# EasyEDA Pro project TeensySensor.eprj, schematic Sigyn Sensor Board

## Sheets
1 Teensy: Board Name: Board1; Create Date: 2025-06-20; Page Name: Teensy; Project Name: TeensySensor; Schematic Name: Sigyn Sensor Board; Update Date: 2025-06-20; Company: Wimble Robotics; Drawed: Michael Wimble; Page Size: A4; Part Number: JLCPCB-002; Reviewed: Michael Wimble; Version: V1.0
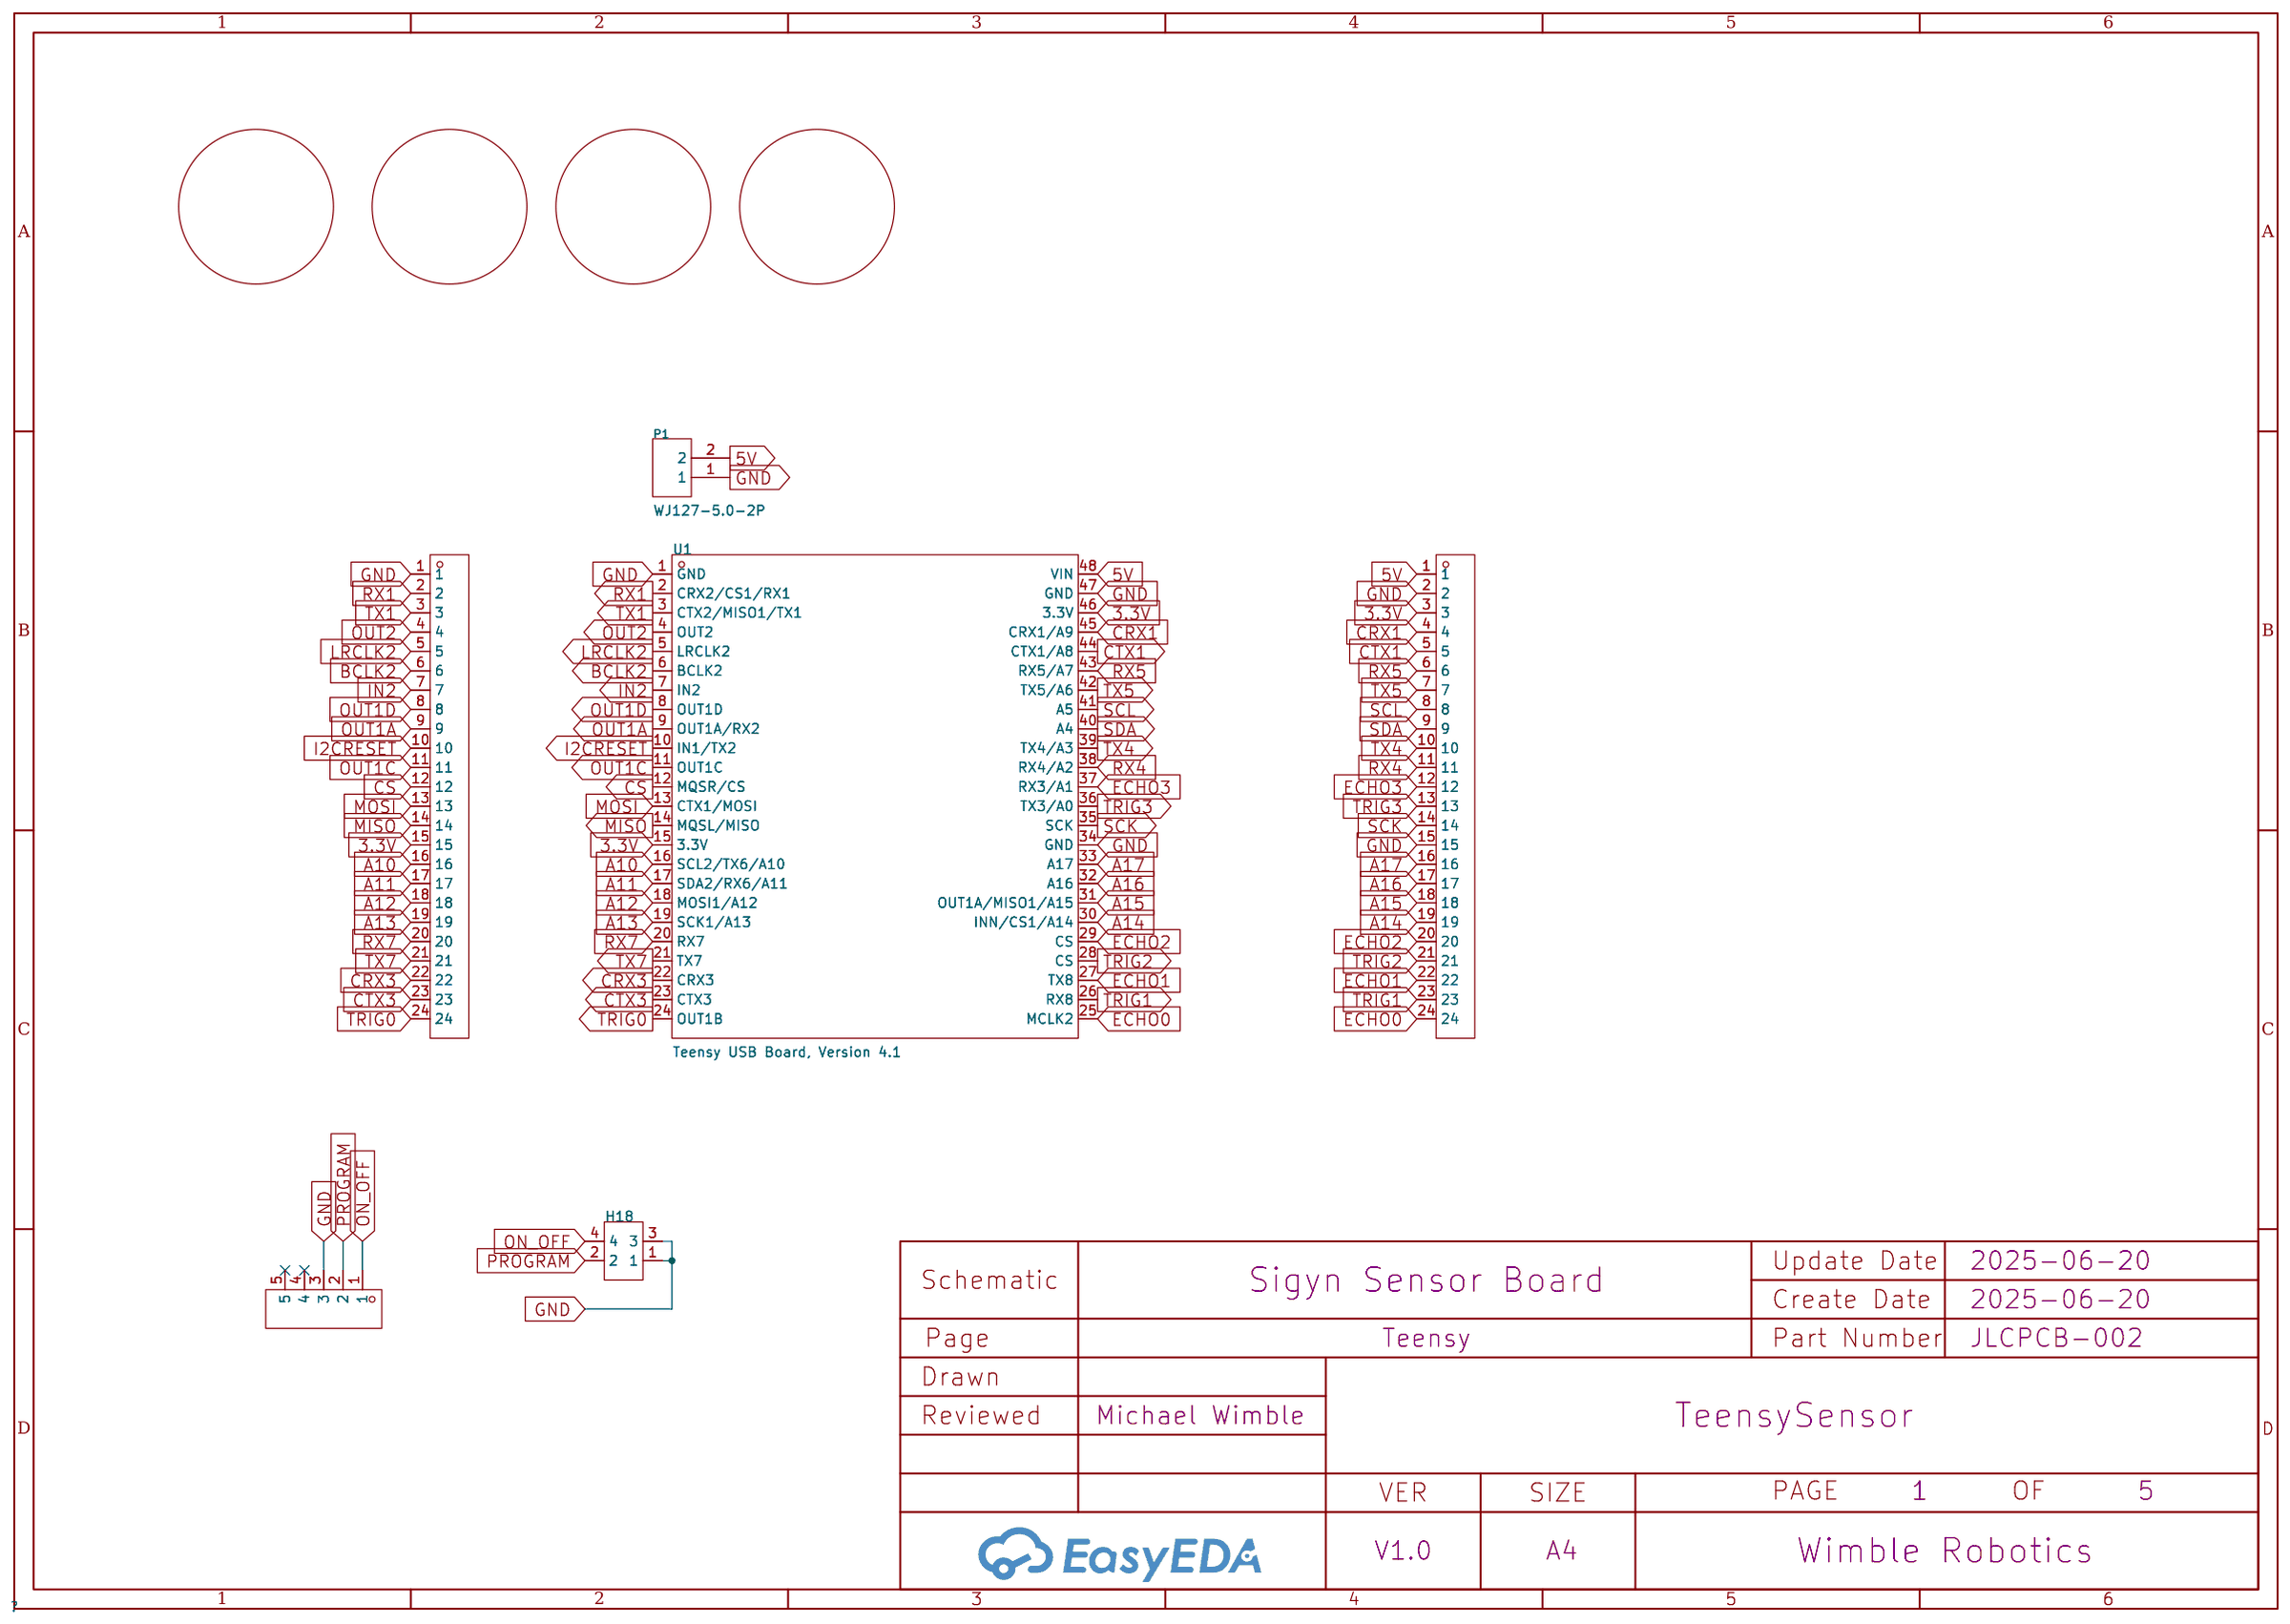
[diagram p0: Teensy]
2 Time of Flight Sensors: Page Name: Time of Flight Sensors; Update Date: 2025-06-19
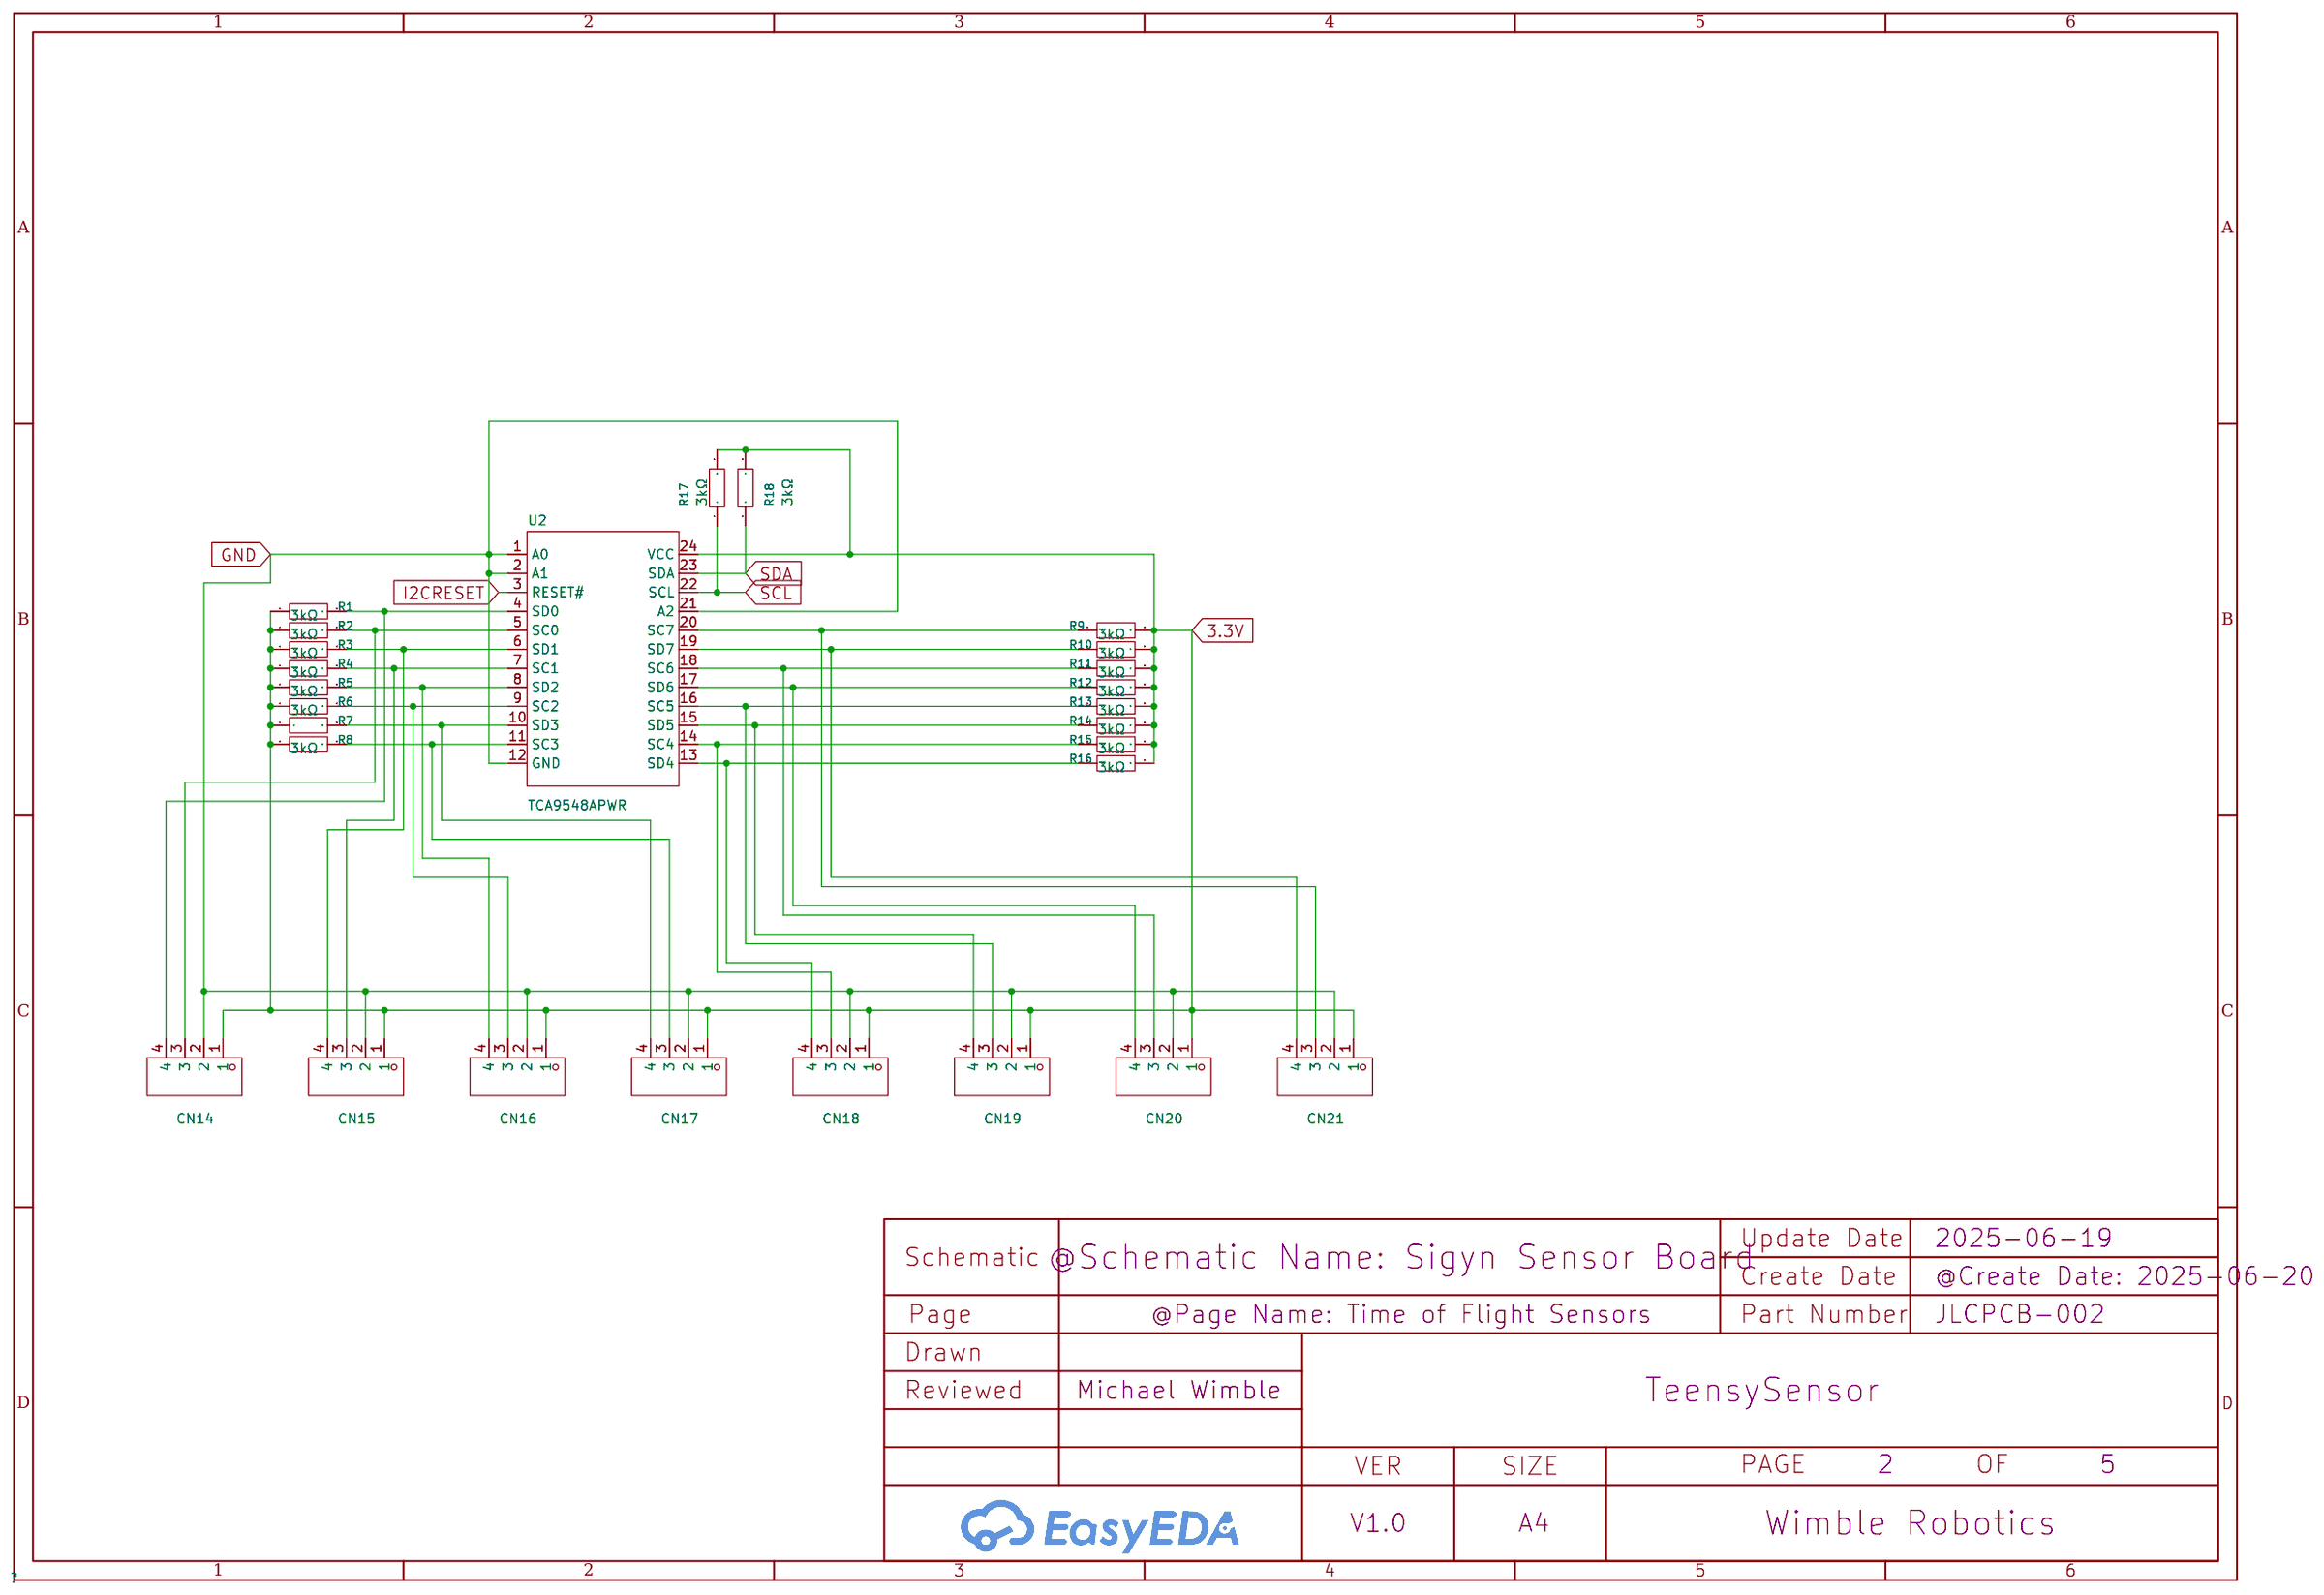
[diagram p1: Time of Flight Sensors]
3 Analog Inputs / Misc: Page Name: Analog Inputs / Misc
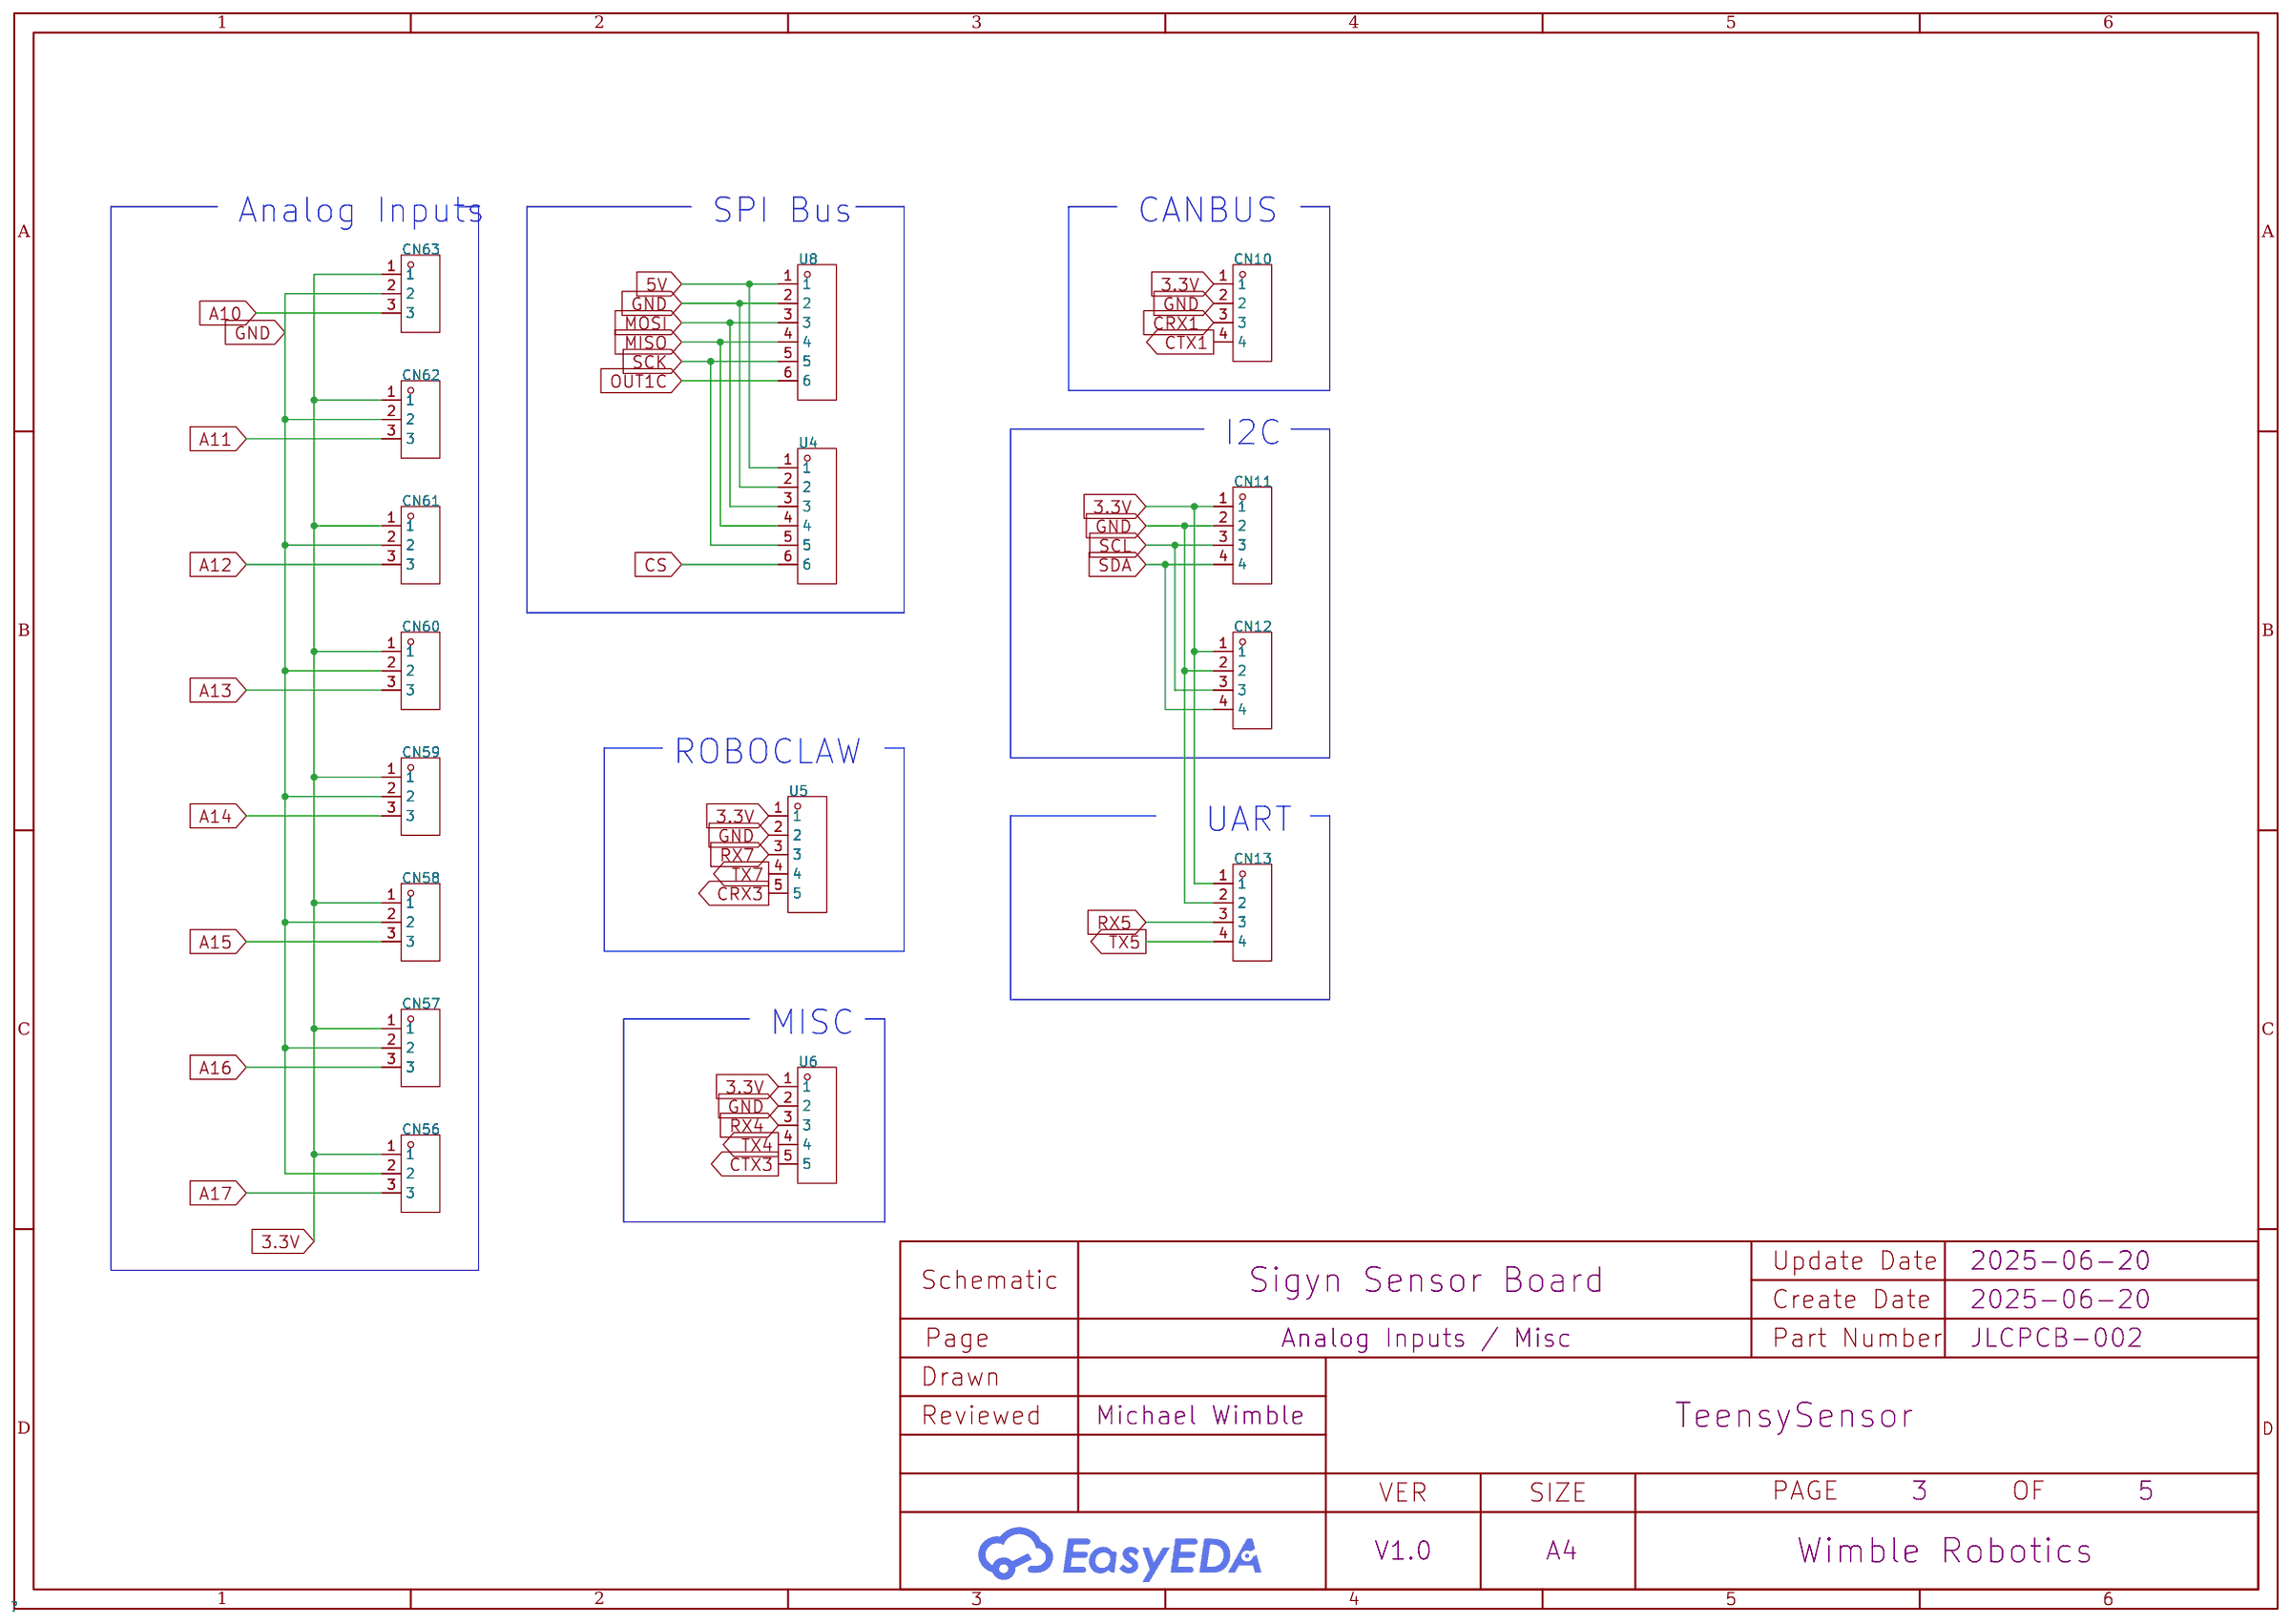
[diagram p2: Analog Inputs / Misc]
4 SONAR: Page Name: SONAR; Update Date: 2025-06-19
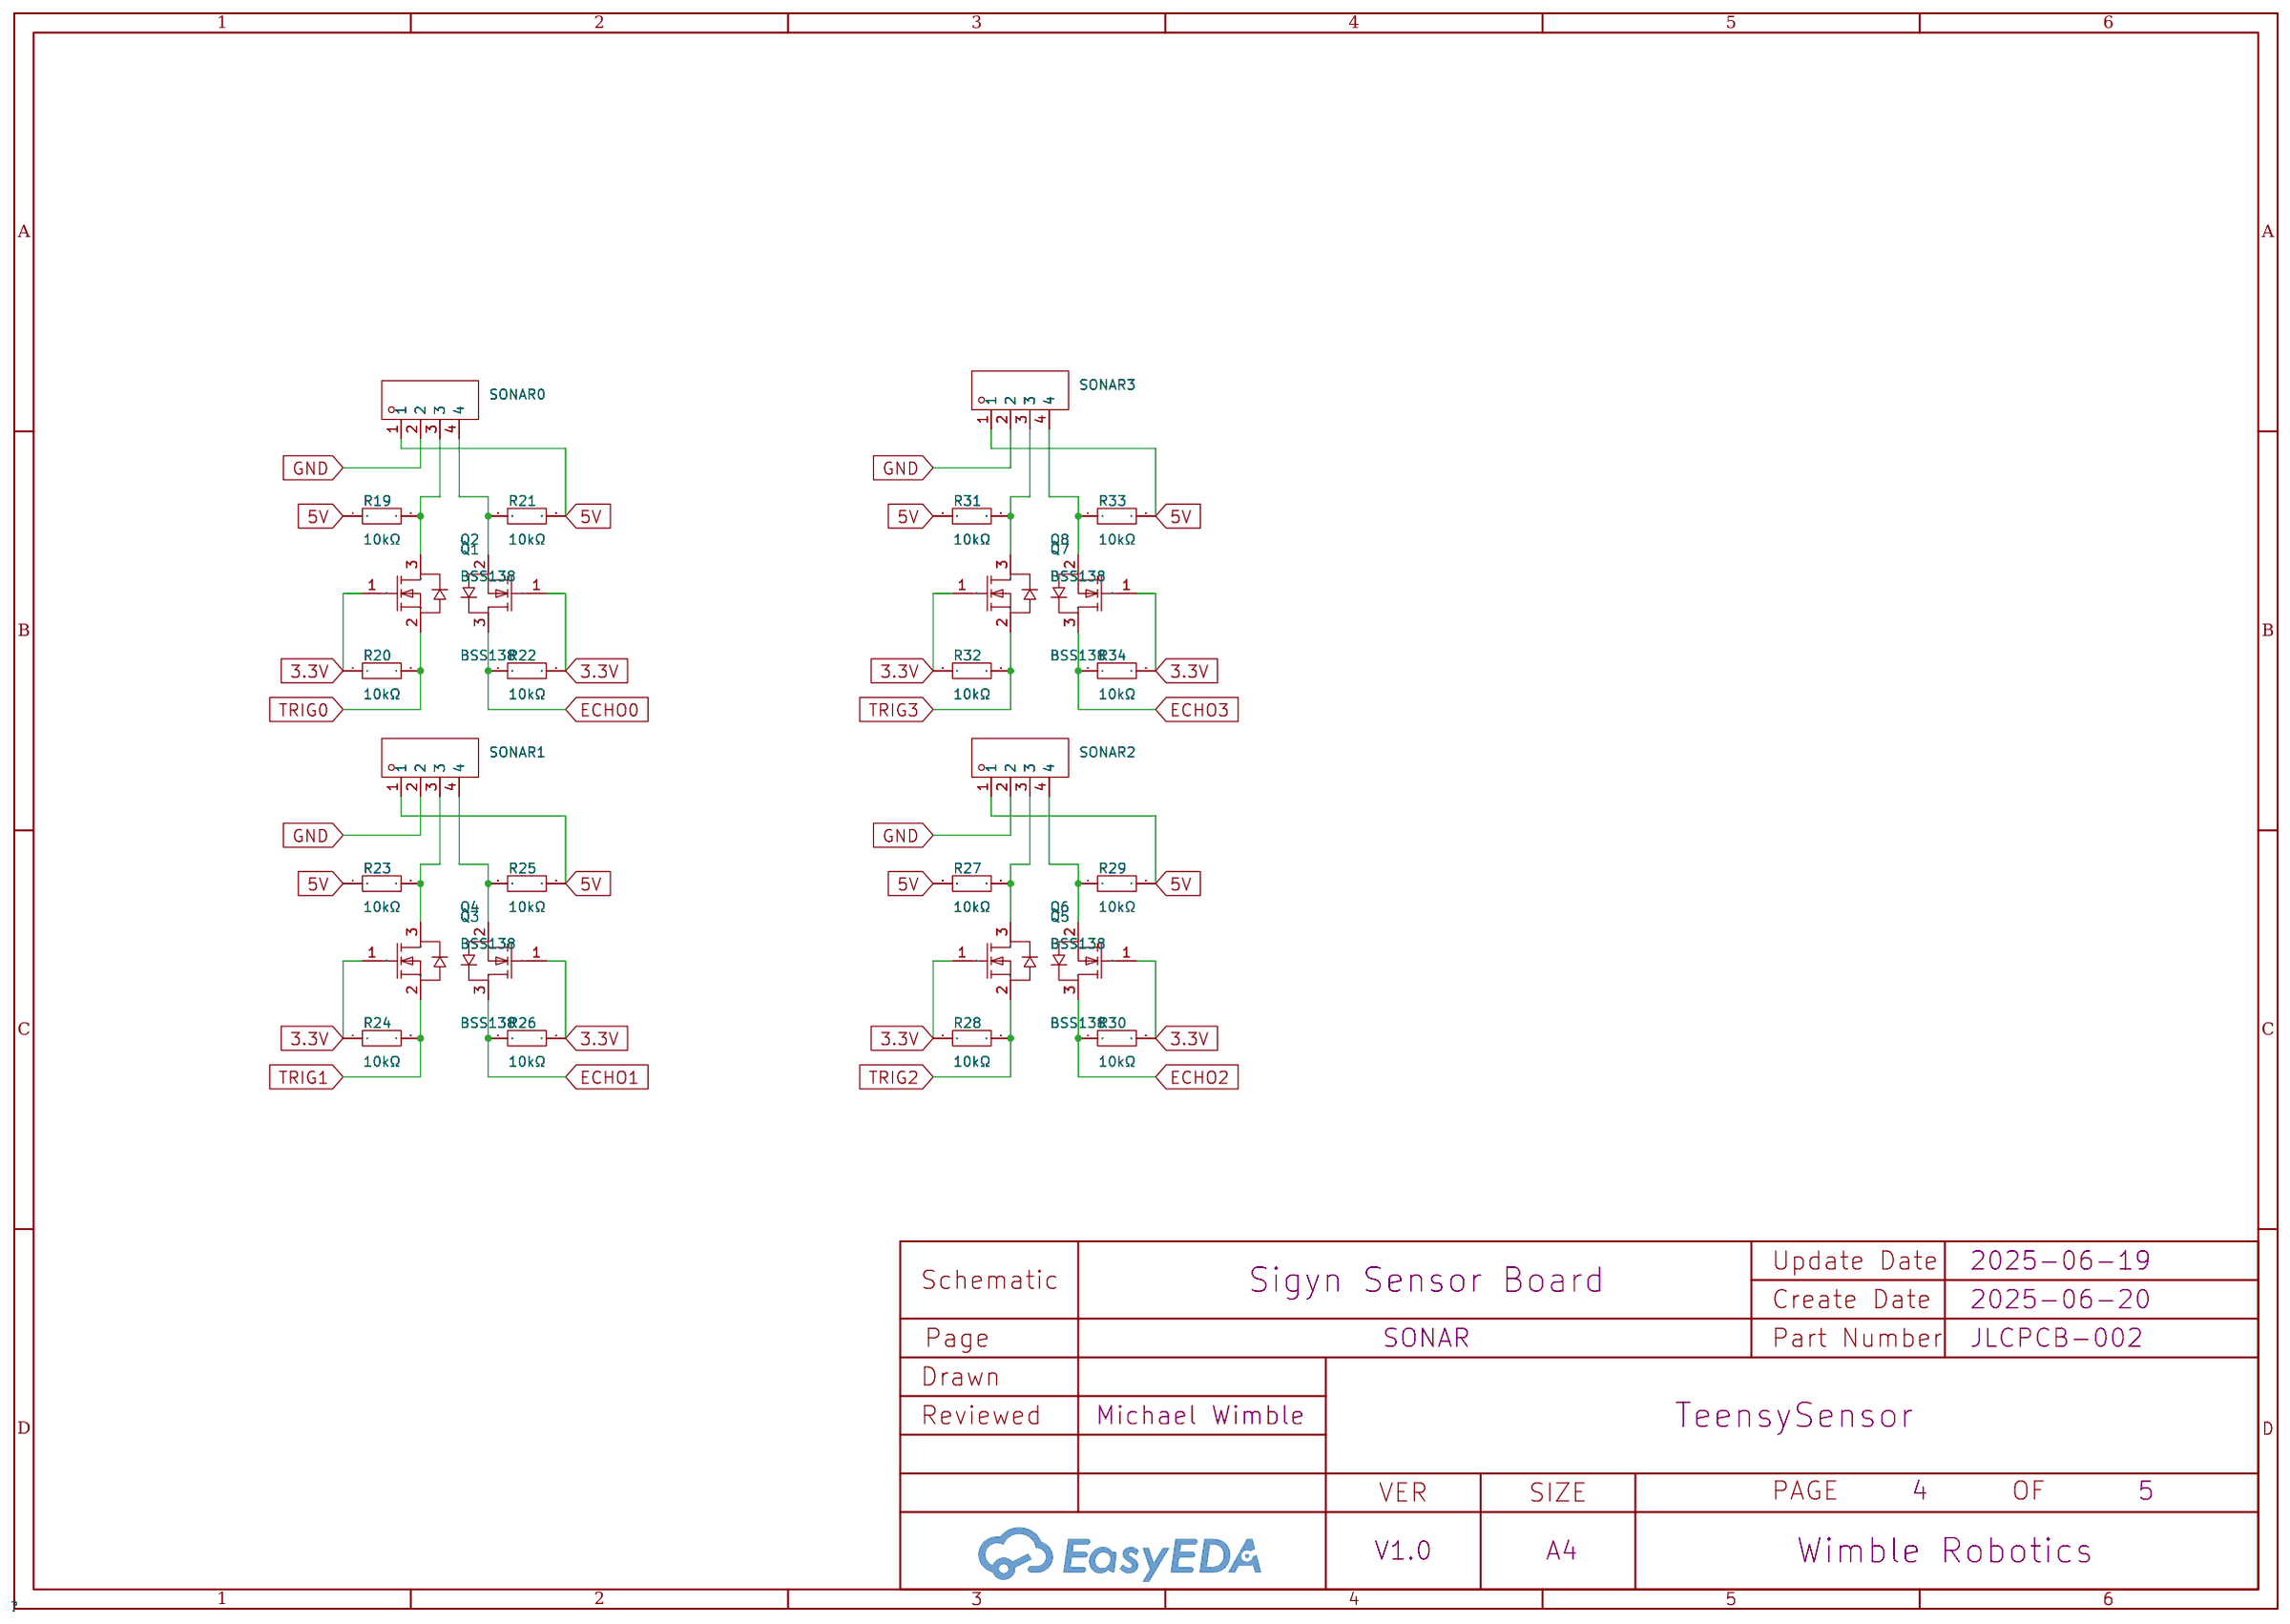
[diagram p3: SONAR]
5 Relays / PWM: Page Name: Relays / PWM
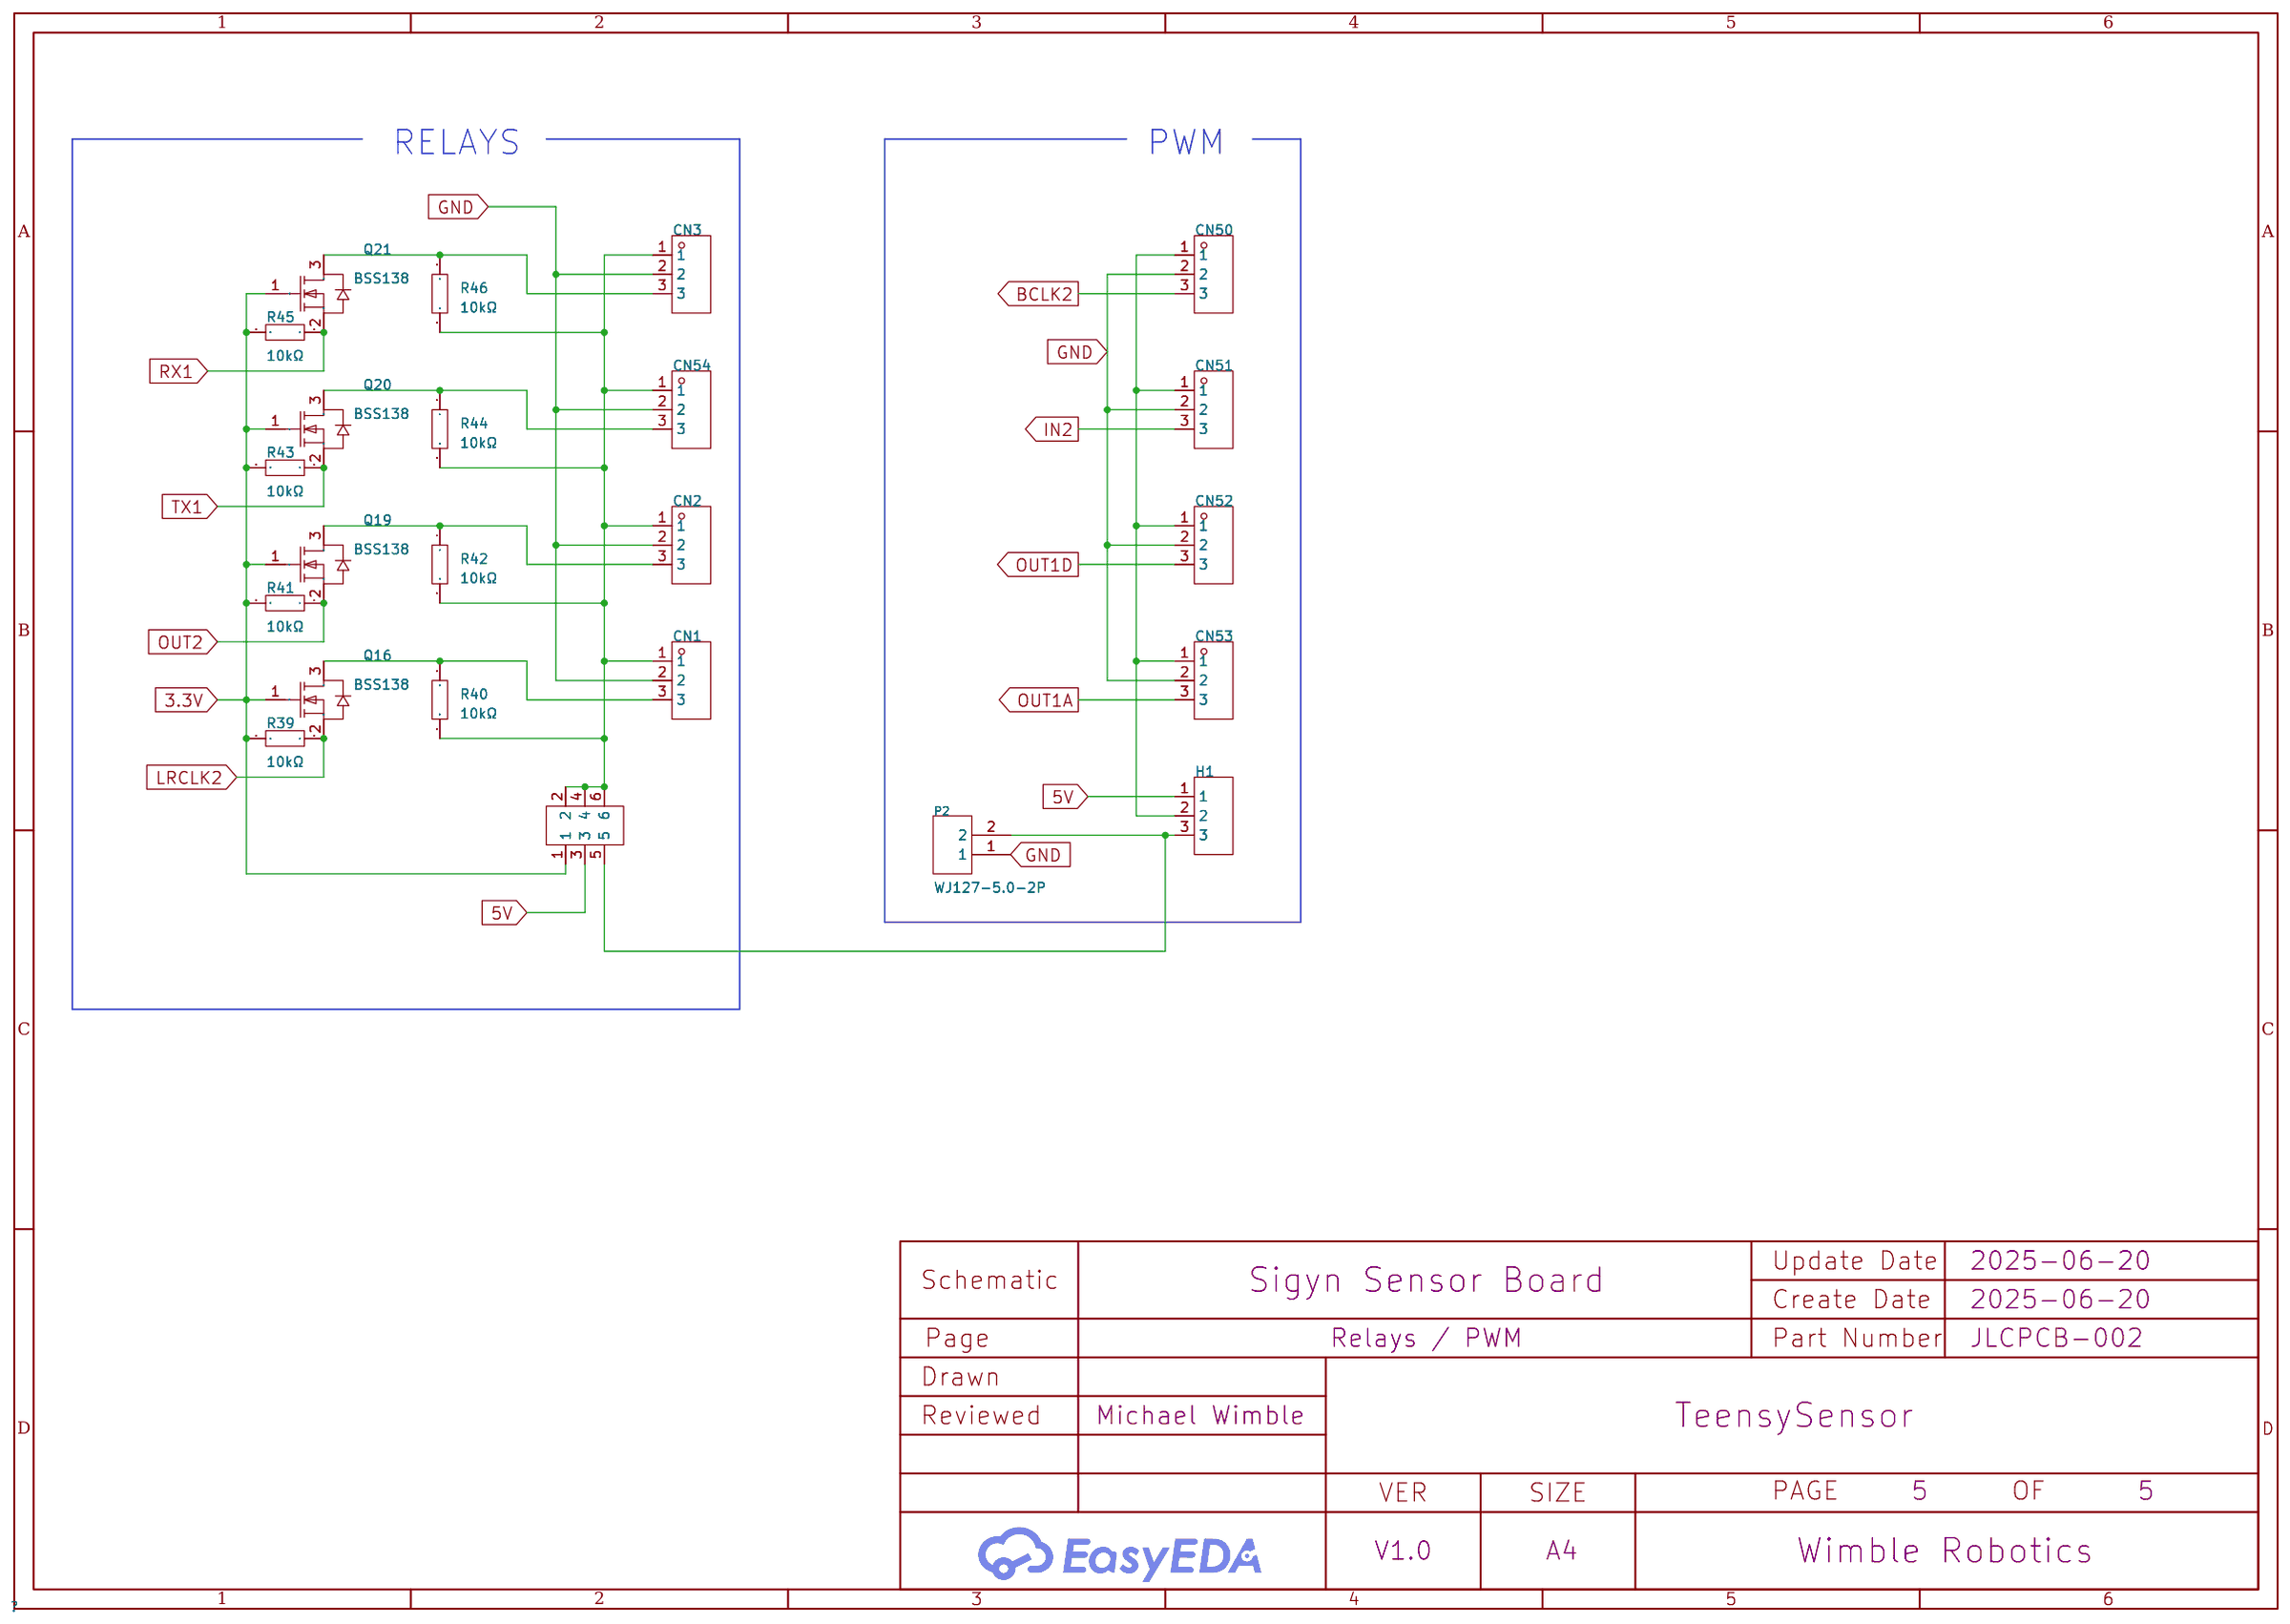
[diagram p4: Relays / PWM]

## Parts
sheet Analog Inputs / Misc
CN10  ZX-XH2.54-4PZZ  [CONN-TH_4P-P2.50_4PIN]
CN11  ZX-XH2.54-4PZZ  [CONN-TH_4P-P2.50_4PIN]
CN12  ZX-XH2.54-4PZZ  [CONN-TH_4P-P2.50_4PIN]
CN13  ZX-XH2.54-4PZZ  [CONN-TH_4P-P2.50_4PIN]
CN56  ZX-XH2.54-3PZZ  [CONN-TH_3P-P2.54_2501S-3P]
CN57  ZX-XH2.54-3PZZ  [CONN-TH_3P-P2.54_2501S-3P]
CN58  ZX-XH2.54-3PZZ  [CONN-TH_3P-P2.54_2501S-3P]
CN59  ZX-XH2.54-3PZZ  [CONN-TH_3P-P2.54_2501S-3P]
CN60  ZX-XH2.54-3PZZ  [CONN-TH_3P-P2.54_2501S-3P]
CN61  ZX-XH2.54-3PZZ  [CONN-TH_3P-P2.54_2501S-3P]
CN62  ZX-XH2.54-3PZZ  [CONN-TH_3P-P2.54_2501S-3P]
CN63  ZX-XH2.54-3PZZ  [CONN-TH_3P-P2.54_2501S-3P]
U4  ZX-XH2.54-6PZZ  [CONN-TH_6P-P2.50_ZX-XH2.54-6PZZ]
U5  ZX-XH2.54-5PZZ  [CONN-TH_5P-P2.50_ZX-XH2.54-5PZZ]
U6  ZX-XH2.54-5PZZ  [CONN-TH_5P-P2.50_ZX-XH2.54-5PZZ]
U8  ZX-XH2.54-6PZZ  [CONN-TH_6P-P2.50_ZX-XH2.54-6PZZ]
sheet Relays / PWM
CN1  ZX-XH2.54-3PZZ  [CONN-TH_3P-P2.54_2501S-3P]
CN2  ZX-XH2.54-3PZZ  [CONN-TH_3P-P2.54_2501S-3P]
CN3  ZX-XH2.54-3PZZ  [CONN-TH_3P-P2.54_2501S-3P]
CN50  ZX-XH2.54-3PZZ  [CONN-TH_3P-P2.54_2501S-3P]
CN51  ZX-XH2.54-3PZZ  [CONN-TH_3P-P2.54_2501S-3P]
CN52  ZX-XH2.54-3PZZ  [CONN-TH_3P-P2.54_2501S-3P]
CN53  ZX-XH2.54-3PZZ  [CONN-TH_3P-P2.54_2501S-3P]
CN54  ZX-XH2.54-3PZZ  [CONN-TH_3P-P2.54_2501S-3P]
H1  PZ254V-11-03P  [HDR-TH_3P-P2.54-V-M]
P2  WJ127-5.0-2P  [CONN-TH_2P-P5.00_CPC3703CTR]
Q16  BSS138  [SOT-23-3_L2.9-W1.6-P1.90-LS2.8-BR]
Q19  BSS138  [SOT-23-3_L2.9-W1.6-P1.90-LS2.8-BR]
Q20  BSS138  [SOT-23-3_L2.9-W1.6-P1.90-LS2.8-BR]
Q21  BSS138  [SOT-23-3_L2.9-W1.6-P1.90-LS2.8-BR]
R39  10kΩ  [R0603]
R40  10kΩ  [R0603]
R41  10kΩ  [R0603]
R42  10kΩ  [R0603]
R43  10kΩ  [R0603]
R44  10kΩ  [R0603]
R45  10kΩ  [R0603]
R46  10kΩ  [R0603]
U19  BX-PZ2.54-2-3PZZ  [HDR-TH_6P-P2.54-V-M-R2-C3-S2.54]
sheet SONAR
Q1  BSS138  [SOT-23-3_L2.9-W1.6-P1.90-LS2.8-BR]
Q2  BSS138  [SOT-23-3_L2.9-W1.6-P1.90-LS2.8-BR]
Q3  BSS138  [SOT-23-3_L2.9-W1.6-P1.90-LS2.8-BR]
Q4  BSS138  [SOT-23-3_L2.9-W1.6-P1.90-LS2.8-BR]
Q5  BSS138  [SOT-23-3_L2.9-W1.6-P1.90-LS2.8-BR]
Q6  BSS138  [SOT-23-3_L2.9-W1.6-P1.90-LS2.8-BR]
Q7  BSS138  [SOT-23-3_L2.9-W1.6-P1.90-LS2.8-BR]
Q8  BSS138  [SOT-23-3_L2.9-W1.6-P1.90-LS2.8-BR]
R19  10kΩ  [R0603]
R20  10kΩ  [R0603]
R21  10kΩ  [R0603]
R22  10kΩ  [R0603]
R23  10kΩ  [R0603]
R24  10kΩ  [R0603]
R25  10kΩ  [R0603]
R26  10kΩ  [R0603]
R27  10kΩ  [R0603]
R28  10kΩ  [R0603]
R29  10kΩ  [R0603]
R30  10kΩ  [R0603]
R31  10kΩ  [R0603]
R32  10kΩ  [R0603]
R33  10kΩ  [R0603]
R34  10kΩ  [R0603]
SONAR0  ZX-XH2.54-4PZZ  [CONN-TH_4P-P2.50_4PIN]
SONAR1  ZX-XH2.54-4PZZ  [CONN-TH_4P-P2.50_4PIN]
SONAR2  ZX-XH2.54-4PZZ  [CONN-TH_4P-P2.50_4PIN]
SONAR3  ZX-XH2.54-4PZZ  [CONN-TH_4P-P2.50_4PIN]
sheet Teensy
H18  HX PZ2.54-2x2P ZZ  [HDR-TH_HX-PZ2.54-2X2P-ZZ]
P1  WJ127-5.0-2P  [CONN-TH_2P-P5.00_CPC3703CTR]
U1  Teensy USB Board, Version 4.1  [COMM-TH_L61.0-W17.8-P2.54]
U12  -  [3.5mm_Hole]
U13  -  [3.5mm_Hole]
U14  -  [3.5mm_Hole]
U15  -  [3.5mm_Hole]
U43  HC-PM254-8.5H-1x24PZ  [HDR-TH_24P-P2.54-V-F]
U44  HC-PM254-8.5H-1x24PZ  [HDR-TH_24P-P2.54-V-F]
U48  PM2.54-1*5  [HDR-TH_5P-P2.54-V-F]
sheet Time of Flight Sensors
CN14  ZX-XH2.54-4PZZ  [CONN-TH_4P-P2.50_4PIN]
CN15  ZX-XH2.54-4PZZ  [CONN-TH_4P-P2.50_4PIN]
CN16  ZX-XH2.54-4PZZ  [CONN-TH_4P-P2.50_4PIN]
CN17  ZX-XH2.54-4PZZ  [CONN-TH_4P-P2.50_4PIN]
CN18  ZX-XH2.54-4PZZ  [CONN-TH_4P-P2.50_4PIN]
CN19  ZX-XH2.54-4PZZ  [CONN-TH_4P-P2.50_4PIN]
CN20  ZX-XH2.54-4PZZ  [CONN-TH_4P-P2.50_4PIN]
CN21  ZX-XH2.54-4PZZ  [CONN-TH_4P-P2.50_4PIN]
R1  3kΩ  [R0603]
R2  3kΩ  [R0603]
R3  3kΩ  [R0603]
R4  3kΩ  [R0603]
R5  3kΩ  [R0603]
R6  3kΩ  [R0603]
R7  3kΩ  [R0603]
R8  3kΩ  [R0603]
R9  3kΩ  [R0603]
R10  3kΩ  [R0603]
R11  3kΩ  [R0603]
R12  3kΩ  [R0603]
R13  3kΩ  [R0603]
R14  3kΩ  [R0603]
R15  3kΩ  [R0603]
R16  3kΩ  [R0603]
R17  3kΩ  [R0603]
R18  3kΩ  [R0603]
U2  TCA9548APWR  [TSSOP-24_L7.8-W4.4-P0.65-LS6.4-BL]

## Library data of the parts
CN10-CN21 SONAR0-SONAR3 = ZX-XH2.54-4PZZ: Pins Structure:1x4P Pitch:2.5mm Mounting Type:Direct Insert Reference Series:XH Number of Pins:4P Number of Rows:1 Number of PINs Per Row:4 Row Spacing:- Rated Current:3A Contact Material:Brass Contact Plating:Tin Operating Temperature:-25℃~+85℃ Operating; LCSC Part Name: 1x4P 间距:2.5mm 直插 系列:XH; Supplier Part: C7429634; Manufacturer: Megastar(兆星); Supplier Footprint: 插件,P=2.5mm; JLCPCB Part Class: Extended Part; Datasheet: https://atta.szlcsc.com/upload/public/pdf/source/20230619/B529A2163E0159A644AB3383D208FB03.pdf; Supplier: LCSC; Pins Structure: 1x4P; Pitch: 2.5mm; Mounting Type: Direct Insert; Reference Series: XH; Number of Pins: 4P; Number of Rows: 1; Number of PINs Per Row: 4; Rated Current: 3A; Contact Material: Brass; Contact Plating: Tin; Operating Temperature: -25℃~+85℃; Rated Voltage (Max): 250V; Plastic Material: PA66; Flame Retardant Rating: UL94V-0; Color: White; Z-Height of the Board: 7mm; X-Length of Bottom Edge on Board (Spacing Line): 12.5mm; Y-Width of Bottom Edge on Board: 5.9mm
CN1-CN3 CN50-CN54 CN56-CN63 = ZX-XH2.54-3PZZ: Pins Structure:1x3P Pitch:2.5mm Mounting Type:Direct Insert Reference Series:XH Number of Pins:3P Number of Rows:1 Number of PINs Per Row:3 Row Spacing:- Rated Current:3A Contact Material:Brass Contact Plating:Tin Operating Temperature:-25℃~+85℃ Operating; LCSC Part Name: 1x3P 间距:2.5mm 直插 系列:XH; Supplier Part: C7429633; Manufacturer: Megastar(兆星); Supplier Footprint: 插件,P=2.5mm; JLCPCB Part Class: Extended Part; Datasheet: https://atta.szlcsc.com/upload/public/pdf/source/20230619/AE17037A2CFDBE8D9CBA775D61AD0A84.pdf; Supplier: LCSC; Pins Structure: 1x3P; Pitch: 2.5mm; Mounting Type: Direct Insert; Reference Series: XH; Number of Pins: 3P; Number of Rows: 1; Number of PINs Per Row: 3; Rated Current: 3A; Contact Material: Brass; Contact Plating: Tin; Operating Temperature: -25℃~+85℃; Rated Voltage (Max): 250V; Plastic Material: PA66; Flame Retardant Rating: UL94V-0; Color: White; Z-Height of the Board: 7mm; X-Length of Bottom Edge on Board (Spacing Line): 10mm; Y-Width of Bottom Edge on Board: 5.9mm
U4 U8 = ZX-XH2.54-6PZZ: Pins Structure:1x6P Pitch:2.5mm Mounting Type:Direct Insert Reference Series:XH Number of Pins:6P Number of Rows:1 Number of PINs Per Row:6 Row Spacing:- Rated Current:3A Contact Material:Brass Contact Plating:Tin Operating Temperature:-25℃~+85℃ Operating; LCSC Part Name: 1x6P 间距:2.5mm 直插 系列:XH; Supplier Part: C7429636; Manufacturer: Megastar(兆星); Supplier Footprint: 插件,P=2.5mm; JLCPCB Part Class: Extended Part; Datasheet: https://atta.szlcsc.com/upload/public/pdf/source/20230619/1243AD0A516E39CD3D274D8985780568.pdf; Supplier: LCSC; Pins Structure: 1x6P; Pitch: 2.5mm; Mounting Type: Direct Insert; Reference Series: XH; Number of Pins: 6P; Number of Rows: 1; Number of PINs Per Row: 6; Rated Current: 3A; Contact Material: Brass; Contact Plating: Tin; Operating Temperature: -25℃~+85℃; Rated Voltage (Max): 250V; Plastic Material: PA66; Flame Retardant Rating: UL94V-0; Color: White; Z-Height of the Board: 7mm; X-Length of Bottom Edge on Board (Spacing Line): 17.5mm; Y-Width of Bottom Edge on Board: 5.9mm
U5 U6 = ZX-XH2.54-5PZZ: Pins Structure:1x5P Pitch:2.5mm Mounting Type:Direct Insert Reference Series:XH Number of Pins:5P Number of Rows:1 Number of PINs Per Row:5 Row Spacing:- Rated Current:3A Contact Material:Brass Contact Plating:Tin Operating Temperature:-25℃~+85℃ Operating; LCSC Part Name: 1x5P 间距:2.5mm 直插 系列:XH; Supplier Part: C7429635; Manufacturer: Megastar(兆星); Supplier Footprint: 插件,P=2.5mm; JLCPCB Part Class: Extended Part; Datasheet: https://atta.szlcsc.com/upload/public/pdf/source/20230619/60EEF4ADD558E90BFFACF5D939816781.pdf; Supplier: LCSC; Pins Structure: 1x5P; Pitch: 2.5mm; Mounting Type: Direct Insert; Reference Series: XH; Number of Pins: 5P; Number of Rows: 1; Number of PINs Per Row: 5; Rated Current: 3A; Contact Material: Brass; Contact Plating: Tin; Operating Temperature: -25℃~+85℃; Rated Voltage (Max): 250V; Plastic Material: PA66; Flame Retardant Rating: UL94V-0; Color: White; Z-Height of the Board: 7mm; X-Length of Bottom Edge on Board (Spacing Line): 15mm; Y-Width of Bottom Edge on Board: 5.9mm
H1 = PZ254V-11-03P: Pin Structure:1x3P Pitch:2.54mm Row Spacing:- Circluar Pins/Square Pins:Policy Mounting Type:Straight Number of Rows:Single Row Number of Pins:3P Current Rating:3A Voltage Rating (Max):250V Length of Mating Pin:6mm Insulation Height:2.5mm Length of End Co; LCSC Part Name: 1x3P 间距:2.54mm 方针 直插; Supplier Part: C2937625; Manufacturer: XFCN(兴飞); Supplier Footprint: 插件,P=2.54mm; JLCPCB Part Class: Extended Part; Datasheet: https://atta.szlcsc.com/upload/public/pdf/source/20200309/C492402_8335C3D49C4E4C618838D59BB1D024C1.pdf; Supplier: LCSC; Pin Structure: 1x3P; Pitch: 2.54mm; Circluar Pins/Square Pins: Policy; Mounting Type: Straight; Number of Rows: Single Row; Number of Pins: 3P; Current Rating: 3A; Voltage Rating (Max): 250V; Length of Mating Pin: 6mm; Insulation Height: 2.5mm; Length of End Connection Pin: 3mm; Operating Temperature: -40℃~+105℃; Color: Black
P1 P2 = WJ127-5.0-2P_C3703: Structure:1x2P Pitch:5mm Color:Green Mounting Style:Straight Current Rating (Max):15A Voltage Rating (Max):250V Number of Pins:2P Number of Rows:1 Wire Gauge - AWG:14~26 Wire Gauge - AWG:14~26 Wire Gauge - mm2:1.5 Wire Gauge - mm2:1.5 Number of PINs Per R; LCSC Part Name: 5mm 1x2P 排数:1 每排P数:2 直插; Supplier Part: C3703; Manufacturer: KANGNEX(康奈克斯电气); Supplier Footprint: 插件,P=5mm; JLCPCB Part Class: Extended Part; Datasheet: https://atta.szlcsc.com/upload/public/pdf/source/20191225/C3703_1F4D1F1BB9E32B564BC518663FFF2A0C.pdf; Supplier: LCSC; Structure: 1x2P; Pitch: 5mm; Color: Green; Mounting Style: Straight; Current Rating (Max): 15A; Voltage Rating (Max): 250V; Number of Pins: 2P; Number of Rows: 1; Wire Gauge - AWG: 14~26; Wire Gauge - mm2: 1.5; Number of PINs Per Row: 2; Operating Temperature Range: -40℃~+105℃
Q1-Q8 Q16 Q19-Q21 = BSS138_C18212695: Drain to Source Voltage:50V Current - Continuous Drain(Id):360mA RDS(on):2Ω@2.5V,0.1A Pd - Power Dissipation:350mW Gate Threshold Voltage (Vgs(th)@Id):800mV Gate Charge(Qg):4nC@25V Input Capacitance(Ciss@Vds):32pF Reverse Transfer Capacitance (Crss@Vds):3; LCSC Part Name: 耐压:50V 电流:360mA; Supplier Part: C18212695; Manufacturer: TECH PUBLIC(台舟); Supplier Footprint: SOT-23; JLCPCB Part Class: Extended Part; Datasheet: https://atta.szlcsc.com/upload/public/pdf/source/20231024/96ACE9C5A32B7F4113654DA9CE24FCA4.pdf; Supplier: LCSC; Drain to Source Voltage: 50V; Current - Continuous Drain(Id): 360mA; RDS(on): 2Ω@2.5V,0.1A; Pd - Power Dissipation: 350mW; Gate Threshold Voltage (Vgs(th)@Id): 800mV; Gate Charge(Qg): 4nC@25V; Input Capacitance(Ciss@Vds): 32pF; Reverse Transfer Capacitance (Crss@Vds): 3pF@25V; Operating Temperature: -55℃~+150℃
R19-R34 R39-R46 = RC0603FR-0710KL: Type:Thick Film Resistors Resistance: Tolerance:±1% Tolerance:±1% Power(Watts): Overload Voltage (Max): Temperature Coefficient:±100ppm/℃ Temperature Coefficient:±100ppm/℃ Operating Temperature Range:-55℃~+155℃ Operating Temperature Range:-55℃~+155℃; LCSC Part Name: 厚膜电阻 10kΩ ±1% 100mW; Supplier Part: C98220; Manufacturer: YAGEO(国巨); Supplier Footprint: 0603; JLCPCB Part Class: Extended Part; Datasheet: https://atta.szlcsc.com/upload/public/pdf/source/20180927/C295883_E8D83085EA81BD7DE0B2B681138C15EE.pdf; Supplier: LCSC; Type: Thick Film Resistors; Tolerance: ±1%; Temperature Coefficient: ±100ppm/℃; Operating Temperature Range: -55℃~+155℃
U19 = BX-PZ2.54-2-3PZZ: Pin Structure:2x3P Pitch:2.54mm Row Spacing:2.54mm Circluar Pins/Square Pins:Policy Mounting Type:Straight Number of Rows:Double Row Number of Pins:3P Current Rating:3A Voltage Rating (Max):1kV Length of Mating Pin:6mm Insulation Height:2.5mm Length of En; LCSC Part Name: 2x3P 间距:2.54mm 方针 直插; Supplier Part: C18078212; Manufacturer: Bossie(博锡); Supplier Footprint: 插件,P=2.54mm; JLCPCB Part Class: Extended Part; Datasheet: https://atta.szlcsc.com/upload/public/pdf/source/20231017/19B93BCADDDD73CB54F402EECF4A0840.pdf; Supplier: LCSC; Pin Structure: 2x3P; Pitch: 2.54mm; Row Spacing: 2.54mm; Circluar Pins/Square Pins: Policy; Mounting Type: Straight; Number of Rows: Double Row; Number of Pins: 3P; Current Rating: 3A; Voltage Rating (Max): 1kV; Length of Mating Pin: 6mm; Insulation Height: 2.5mm; Length of End Connection Pin: 3mm; Contact Material: Brass; Contact Plating: Gold; Operating Temperature: -40℃~+105℃; Color: Black
H18 = HX PZ2.54-2x2P ZZ: Pin Structure:2x2P Pitch:2.54mm Row Spacing:2.54mm Circluar Pins/Square Pins:Policy Mounting Type:Straight Number of Rows:Double Row Number of Pins:4P Current Rating:3A Voltage Rating (Max):- Length of Mating Pin:6mm Insulation Height:2.5mm Length of End; LCSC Part Name: 2x2P 间距:2.54mm 方针 直插; Supplier Part: C32713275; Manufacturer: hanxia(韩下); Supplier Footprint: 插件,P=2.54mm; JLCPCB Part Class: Extended Part; Datasheet: https://atta.szlcsc.com/upload/public/pdf/source/20240723/CE5FF0E3D3DC0CA9D26CA3411A561CD4.pdf; Supplier: LCSC; Pin Structure: 2x2P; Pitch: 2.54mm; Row Spacing: 2.54mm; Circluar Pins/Square Pins: Policy; Mounting Type: Straight; Number of Rows: Double Row; Number of Pins: 4P; Current Rating: 3A; Length of Mating Pin: 6mm; Insulation Height: 2.5mm; Length of End Connection Pin: 3mm; Contact Material: Brass; Contact Plating: Gold; Operating Temperature: -40℃~+105℃; Color: Black
U1 = Teensy USB Board, Version 4.1: Supplier Part: C9900060513; Supplier Footprint: 插件; JLCPCB Part Class: Extended Part; Supplier: LCSC
U12-U15 = 3.5MMHole: Mounting hole
U43 U44 = HC-PM254-8.5H-1x24PZ: Holes Structure:1x24P Pitch:2.54mm Row Spacing:- Circular Hole / Square Hole:Square Hole Mounting Type:Direct Insert Number of Rows:Single Row Number of Positions:24P Current Rating:3A Voltage Rating (Max):- Holes Direction:Top Insulation Height:8.5mm Con; LCSC Part Name: 间距2.54mm 1x24Pin 直插 PC3.0 H8.5; Supplier Part: C41376163; Manufacturer: HC(虹成电子); Supplier Footprint: 插件,P=2.54mm; JLCPCB Part Class: Extended Part; Datasheet: https://atta.szlcsc.com/upload/public/pdf/source/20250106/3FBD04873CC9DF7EB7D4CB725B508409.pdf; Supplier: LCSC; Holes Structure: 1x24P; Pitch: 2.54mm; Circular Hole / Square Hole: Square Hole; Mounting Type: Direct Insert; Number of Rows: Single Row; Number of Positions: 24P; Current Rating: 3A; Holes Direction: Top; Insulation Height: 8.5mm; Contact Material: Brass; Contact Plating: Gold; Operating Temperature: -40℃~+105℃; PIN Length: 3mm
U48 = PM2.54-1*5: Holes Structure:1x5P Pitch:2.54mm Row Spacing:2.54mm Circular Hole / Square Hole:方孔 Mounting Type:Straight Number of Rows:Plugin Number of Holes:5P Current Rating (Max):2.5A Holes Direction:Top Insulation Height:8.5mm Operating Temperature Range:-40℃~+105; LCSC Part Name: 间距:2.54mm 1x5P 直插; Supplier Part: C5116488; Manufacturer: ZHOURI(洲日); Supplier Footprint: 插件,P=2.54mm; JLCPCB Part Class: Extended Part; Datasheet: https://atta.szlcsc.com/upload/public/pdf/source/20220803/9CD49C6F5EDF44A82395C8C3734B0185.pdf; Supplier: LCSC; Holes Structure: 1x5P; Pitch: 2.54mm; Row Spacing: 2.54mm; Circular Hole / Square Hole: 方孔; Mounting Type: Straight; Number of Rows: Plugin; Number of Holes: 5P; Current Rating (Max): 2.5A; Holes Direction: Top; Insulation Height: 8.5mm; Operating Temperature Range: -40℃~+105℃
R1-R18 = 0603WAF3001T5E: Type:Thick Film Resistors Resistance:3kΩ Tolerance:±1% Tolerance:±1% Power(Watts):0.1W Voltage-Supply(Max):75V Temperature Coefficient:±100ppm/℃ Temperature Coefficient:±100ppm/℃ Operating Temperature:-55℃~+155℃ Operating Temperature:-55℃~+155℃; LCSC Part Name: 3kΩ ±1% 100mW 厚膜电阻; Supplier Part: C4211; Manufacturer: UNI-ROYAL(厚声); Supplier Footprint: 0603; JLCPCB Part Class: Basic Part; Datasheet: https://atta.szlcsc.com/upload/public/pdf/source/20200306/C422600_1E6D84923E4A46A82E41ADD87F860B5C.pdf; Supplier: LCSC; Type: Thick Film Resistors; Tolerance: ±1%; Power(Watts): 0.1W; Voltage-Supply(Max): 75V; Temperature Coefficient: ±100ppm/℃; Operating Temperature: -55℃~+155℃
U2 = TCA9548APWR: Supplier Part: C130026; Manufacturer: TI(德州仪器); Supplier Footprint: TSSOP-24; JLCPCB Part Class: Extended Part; Datasheet: https://www.ti.com/cn/lit/gpn/tca9548a; Supplier: LCSC

## Nets
3.3V: CN10.1 CN11.1 CN12.1 CN13.1 CN14.1 CN15.1 CN16.1 CN17.1 CN18.1 CN19.1 CN20.1 CN21.1 CN56.1 CN57.1 CN58.1 CN59.1 CN60.1 CN61.1 CN62.1 CN63.1 Q1.1(G) Q2.1(G) Q3.1(G) Q4.1(G) Q5.1(G) Q6.1(G) Q7.1(G) Q8.1(G) Q16.1(G) Q19.1(G) Q20.1(G) Q21.1(G) R1.1 R2.1 R3.1 R4.1 R5.1 R6.1 R7.1 R8.1 R9.2 R10.2 R11.2 R12.2 R13.2 R14.2 R15.2 R16.2 R17.2 R18.2 R20.1 R22.2 R24.1 R26.2 R28.1 R30.2 R32.1 R34.2 R39.2 R41.2 R43.2 R45.2 U1.15(3.3V) U1.46(3.3V) U2.24(VCC) U5.1 U6.1 U19.1 U43.3 U44.15
5V: H1.1 P1.2 R19.1 R21.2 R23.1 R25.2 R27.1 R29.2 R31.1 R33.2 SONAR0.1 SONAR1.1 SONAR2.1 SONAR3.1 U1.48(VIN) U4.1 U8.1 U19.3 U43.1
GND: CN1.2 CN2.2 CN3.2 CN10.2 CN11.2 CN12.2 CN13.2 CN14.2 CN15.2 CN16.2 CN17.2 CN18.2 CN19.2 CN20.2 CN21.2 CN50.2 CN51.2 CN52.2 CN53.2 CN54.2 CN56.2 CN57.2 CN58.2 CN59.2 CN60.2 CN61.2 CN62.2 CN63.2 H18.1 H18.3 P1.1 P2.1 SONAR0.2 SONAR1.2 SONAR2.2 SONAR3.2 U1.1(GND) U1.34(GND) U1.47(GND) U2.1(A0) U2.2(A1) U2.12(GND) U2.21(A2) U4.2 U5.2 U6.2 U8.2 U43.2 U43.15 U44.1 U48.3
A10: CN63.3 U1.16(SCL2/TX6/A10) U44.16
A11: CN62.3 U1.17(SDA2/RX6/A11) U44.17
A12: CN61.3 U1.18(MOSI1/A12) U44.18
A13: CN60.3 U1.19(SCK1/A13) U44.19
A14: CN59.3 U1.30(INN/CS1/A14) U43.19
A15: CN58.3 U1.31(OUT1A/MISO1/A15) U43.18
A16: CN57.3 U1.32(A16) U43.17
A17: CN56.3 U1.33(A17) U43.16
BCLK2: CN50.3 U1.6(BCLK2) U44.6
CRX1: CN10.3 U1.45(CRX1/A9) U43.4
CRX3: U1.22(CRX3) U5.5 U44.22
CS: U1.12(MQSR/CS) U4.6 U44.12
CTX1: CN10.4 U1.44(CTX1/A8) U43.5
CTX3: U1.23(CTX3) U6.5 U44.23
ECHO0: Q2.3(D) R22.1 U1.25(MCLK2) U43.24
ECHO1: Q4.3(D) R26.1 U1.27(TX8) U43.22
ECHO2: Q6.3(D) R30.1 U1.29(CS) U43.20
ECHO3: Q8.3(D) R34.1 U1.37(RX3/A1) U43.12
I2CRESET: U1.10(IN1/TX2) U2.3(RESET#) U44.10
IN2: CN51.3 U1.7(IN2) U44.7
LRCLK2: Q16.2(S) R39.1 U1.5(LRCLK2) U44.5
MISO: U1.14(MQSL/MISO) U4.4 U8.4 U44.14
MOSI: U1.13(CTX1/MOSI) U4.3 U8.3 U44.13
ON_OFF: H18.4 U48.1
OUT1A: CN53.3 U1.9(OUT1A/RX2) U44.9
OUT1C: U1.11(OUT1C) U8.6 U44.11
OUT1D: CN52.3 U1.8(OUT1D) U44.8
OUT2: Q19.2(S) R41.1 U1.4(OUT2) U44.4
PROGRAM: H18.2 U48.2
RX1: Q21.2(S) R45.1 U1.2(CRX2/CS1/RX1) U44.2
RX4: U1.38(RX4/A2) U6.3 U43.11
RX5: CN13.3 U1.43(RX5/A7) U43.6
RX7: U1.20(RX7) U5.3 U44.20
SCK: U1.35(SCK) U4.5 U8.5 U43.14
SCL: CN11.3 CN12.3 R17.1 U1.41(A5) U2.22(SCL) U43.8
SDA: CN11.4 CN12.4 R18.1 U1.40(A4) U2.23(SDA) U43.9
TRIG0: Q1.2(S) R20.2 U1.24(OUT1B) U44.24
TRIG1: Q3.2(S) R24.2 U1.26(RX8) U43.23
TRIG2: Q5.2(S) R28.2 U1.28(CS) U43.21
TRIG3: Q7.2(S) R32.2 U1.36(TX3/A0) U43.13
TX1: Q20.2(S) R43.1 U1.3(CTX2/MISO1/TX1) U44.3
TX4: U1.39(TX4/A3) U6.4 U43.10
TX5: CN13.4 U1.42(TX5/A6) U43.7
TX7: U1.21(TX7) U5.4 U44.21
$2N1400: CN14.4 R1.2 U2.4(SD0)
$2N1404: CN14.3 R2.2 U2.5(SC0)
$2N1409: CN15.4 R3.2 U2.6(SD1)
$2N1414: CN15.3 R4.2 U2.7(SC1)
$2N1419: CN16.4 R5.2 U2.8(SD2)
$2N1424: CN16.3 R6.2 U2.9(SC2)
$2N2020: CN18.3 R15.1 U2.14(SC4)
$2N2036: CN19.4 R14.1 U2.15(SD5)
$2N2050: CN19.3 R13.1 U2.16(SC5)
$2N2062: CN20.4 R12.1 U2.17(SD6)
$2N2072: CN20.3 R11.1 U2.18(SC6)
$2N2080: CN21.3 R9.1 U2.20(SC7)
$2N2083: CN21.4 R10.1 U2.19(SD7)
$2N2247: CN18.4 R16.1 U2.13(SD4)
$2N3196: CN17.4 R7.2 U2.10(SD3)
$2N3204: CN17.3 R8.2 U2.11(SC3)
$4N429: Q1.3(D) R19.2 SONAR0.3
$4N445: Q2.2(S) R21.1 SONAR0.4
$4N1006: Q4.2(S) R25.1 SONAR1.4
$4N1014: Q3.3(D) R23.2 SONAR1.3
$4N1413: Q5.3(D) R27.2 SONAR2.3
$4N1418: Q6.2(S) R29.1 SONAR2.4
$4N1809: Q7.3(D) R31.2 SONAR3.3
$4N1814: Q8.2(S) R33.1 SONAR3.4
$5N1723: CN1.1 CN2.1 CN3.1 CN54.1 R40.2 R42.2 R44.2 R46.2 U19.2 U19.4 U19.6
$5N2083: CN50.1 CN51.1 CN52.1 CN53.1 H1.2
$5N8442: CN1.3 Q16.3(D) R40.1
$5N8911: CN2.3 Q19.3(D) R42.1
$5N9063: CN54.3 Q20.3(D) R44.1
$5N9217: CN3.3 Q21.3(D) R46.1
$5N9426: H1.3 P2.2 U19.5

Not connected (* = marked no-connect by the designer): U48 4* 5*

## Notes on the sheets
sheet 3
- Analog Inputs
- SPI Bus
- CANBUS
- I2C
- ROBOCLAW
- UART
- MISC
sheet 5
- RELAYS
- PWM
